# Altium schematic sheet USB Type C Power Controller.SchDoc: USB Type C Power Controller
size B; Organization: Drexel University; Address1: ECE Senior Design; Address2: 2018-2019; Address3: ECE-08; Revision: 1.0; SheetNumber: 6; SheetTotal: 9
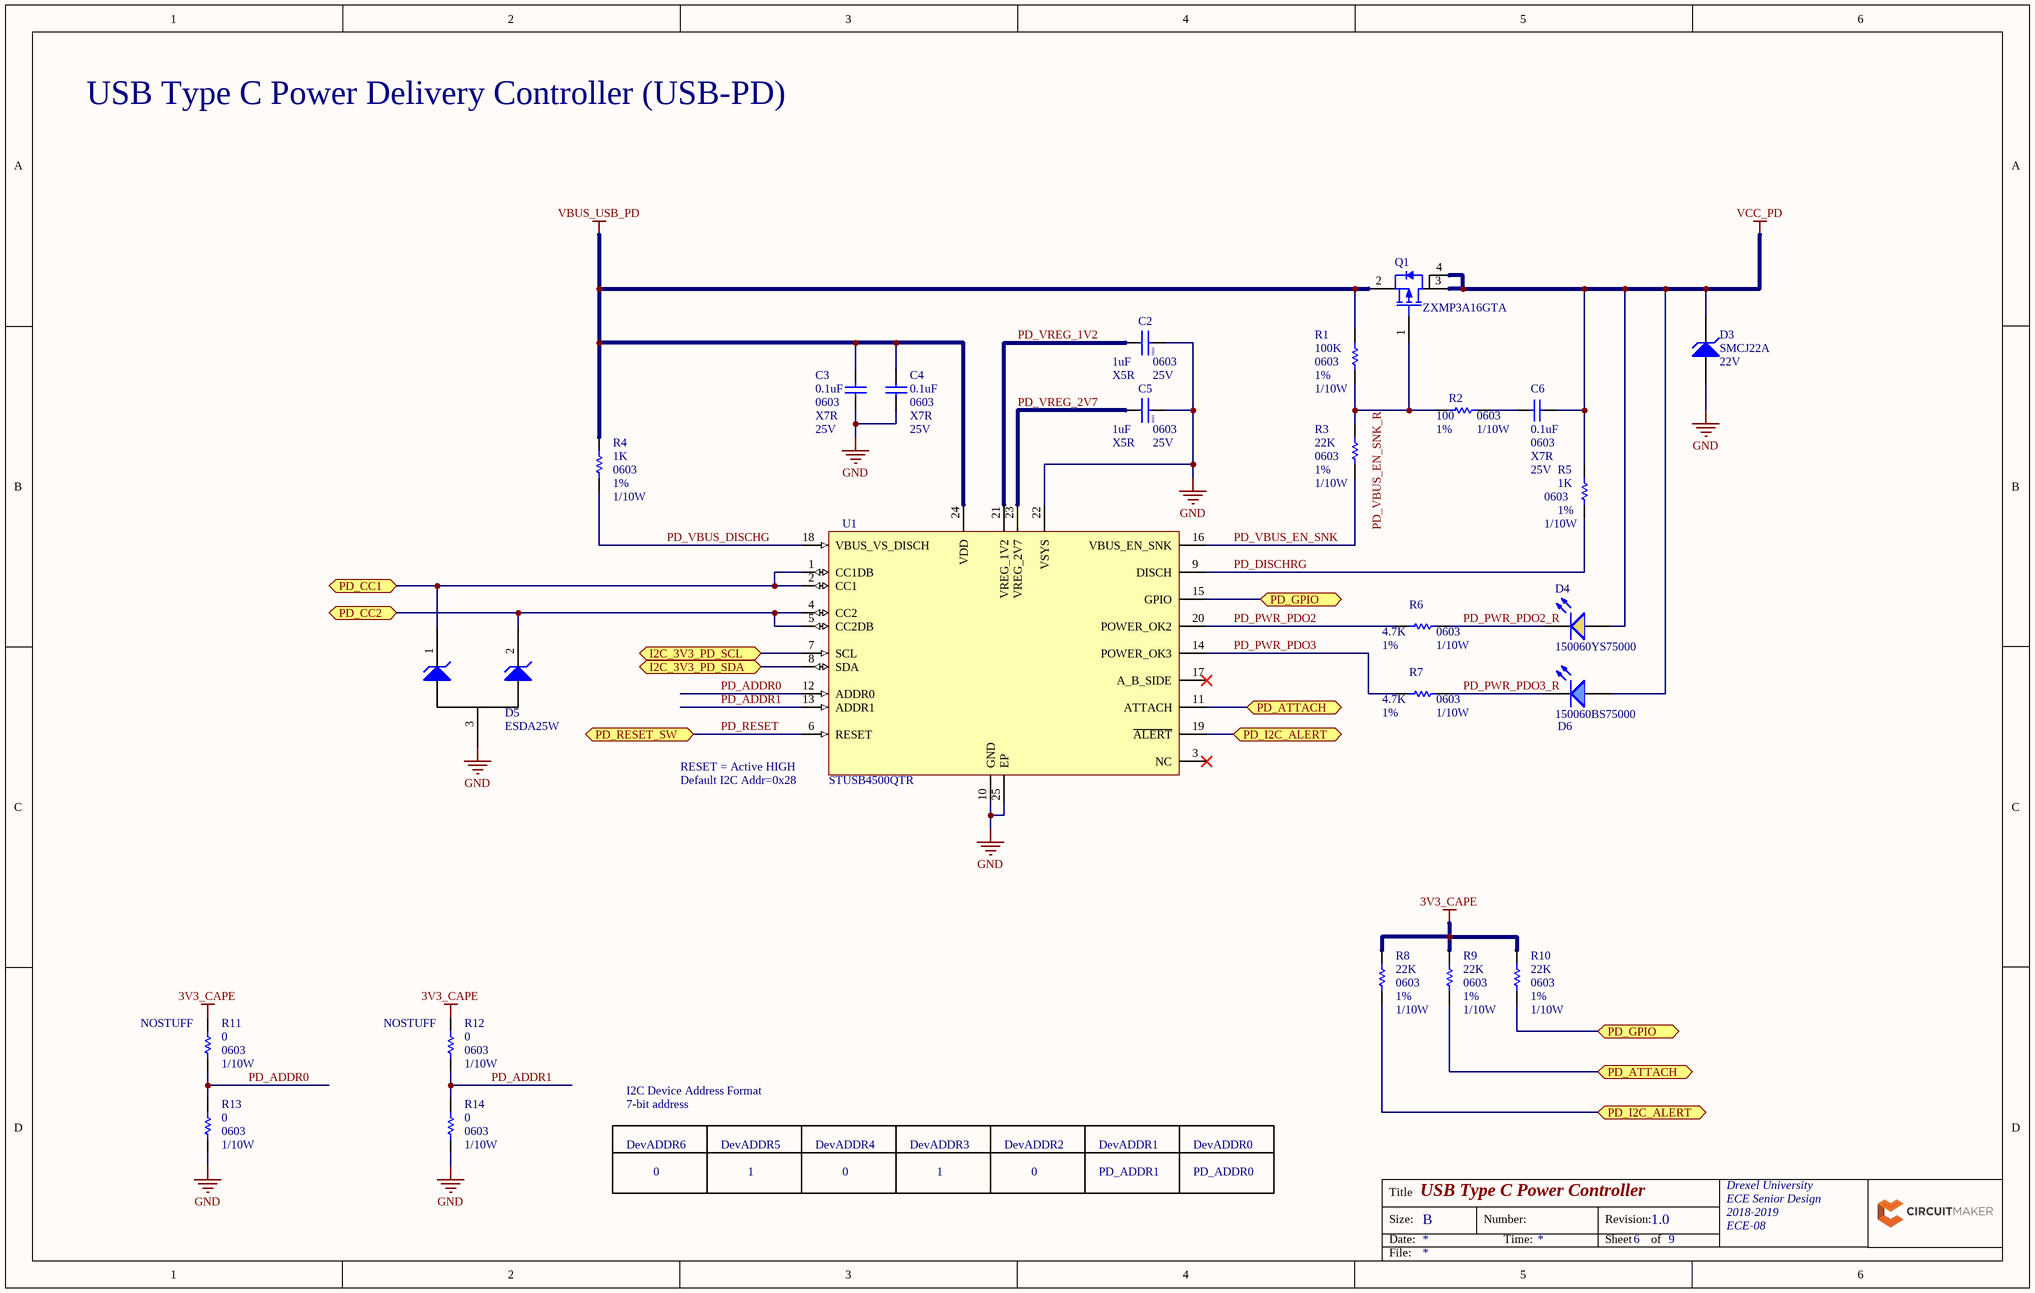
[diagram p0: USB Type C Power Controller.SchDoc]

## Parts
C2  Case/Package: 0603  Dielectric Characteristic: X5R  Capacitance: 1uF  Voltage Rating (DC): 25V  [PCB-bncvufzharetcg4gy1u6-1]  (hidden comment: Taiyo Yuden TMK107BJ105KA-T)
C3  Dielectric Characteristic: X7R  Voltage Rating (DC): 25V  Capacitance: 0.1uF  Package: 0603  [PCB-8usp83j76ntw2xroyu3n-1]  (hidden comment: Würth Elektronik 885012206071)
C4  Dielectric Characteristic: X7R  Voltage Rating (DC): 25V  Capacitance: 0.1uF  Package: 0603  [PCB-8usp83j76ntw2xroyu3n-1]  (hidden comment: Würth Elektronik 885012206071)
C5  Case/Package: 0603  Dielectric Characteristic: X5R  Capacitance: 1uF  Voltage Rating (DC): 25V  [PCB-bncvufzharetcg4gy1u6-1]  (hidden comment: Taiyo Yuden TMK107BJ105KA-T)
C6  Dielectric Characteristic: X7R  Voltage Rating (DC): 25V  Capacitance: 0.1uF  Package: 0603  [PCB-8usp83j76ntw2xroyu3n-1]  (hidden comment: Würth Elektronik 885012206071)
D3  SMCJ22A  Reverse Voltage: 22V  [PCB-gk7qhtajnaxh6qo3xtq4-1]
D4  150060YS75000  [PCB-pyamyqkabampf41w6k2s-1]
D5  Manufacturer Part Number: ESDA25W  [SOT65P210X110-3N]  (hidden comment: D Zener)
D6  150060BS75000  [PCB-q13q7q9xcpj9ke5g4s5g-1]
Q1  Manufacturer Part Number: ZXMP3A16GTA  [SOT230P700X160-4N]  (hidden comment: SYM-6957a0575e87b690-1)
R1  Resistance: 100K  Power Rating: 1/10W  Package: 0603  Tolerance: 1%  [PCB-js3e944hkesj3cskg8px-1]  (hidden comment: Res1)
R2  Case/Package: 0603  Power Rating: 1/10W  Resistance: 100  Resistance Tolerance: 1%  [PCB-85l72t2kcrpp9pohrqyw-1]  (hidden comment: Stackpole Electronics RMCF0603FG100R)
R3  Resistance: 22K  Resistance Tolerance: 1%  Case/Package: 0603  Power Rating: 1/10W  [RESC1608X55X25LL10T15]  (hidden comment: Yageo RC0603FR-0722KL)
R4  Case/Package: 0603  Power Rating: 1/10W  Resistance: 1K  Resistance Tolerance: 1%  [PCB-rzdzs5ckhrcob8ss0hvn-1]  (hidden comment: Stackpole Electronics RMCF0603FT1K00)
R5  Case/Package: 0603  Power Rating: 1/10W  Resistance: 1K  Resistance Tolerance: 1%  [PCB-rzdzs5ckhrcob8ss0hvn-1]  (hidden comment: Stackpole Electronics RMCF0603FT1K00)
R6  Resistance: 4.7K  Package: 0603  Power Rating: 1/10W  Tolerance: 1%  [CAPC1608X90X35NL15T15]  (hidden comment: 4k7)
R7  Resistance: 4.7K  Package: 0603  Power Rating: 1/10W  Tolerance: 1%  [CAPC1608X90X35NL15T15]  (hidden comment: 4k7)
R8  Resistance: 22K  Resistance Tolerance: 1%  Case/Package: 0603  Power Rating: 1/10W  [RESC1608X55X25LL10T15]  (hidden comment: Yageo RC0603FR-0722KL)
R9  Resistance: 22K  Resistance Tolerance: 1%  Case/Package: 0603  Power Rating: 1/10W  [RESC1608X55X25LL10T15]  (hidden comment: Yageo RC0603FR-0722KL)
R10  Resistance: 22K  Resistance Tolerance: 1%  Case/Package: 0603  Power Rating: 1/10W  [RESC1608X55X25LL10T15]  (hidden comment: Yageo RC0603FR-0722KL)
R11  Supplier Device Package: 0603  Resistance: 0  Power: 1/10W  [PCB-vghjuybc2rzv8513tm8h-1]  (hidden comment: Res1)
R12  Supplier Device Package: 0603  Resistance: 0  Power: 1/10W  [PCB-vghjuybc2rzv8513tm8h-1]  (hidden comment: Res1)
R13  Supplier Device Package: 0603  Resistance: 0  Power: 1/10W  [PCB-vghjuybc2rzv8513tm8h-1]  (hidden comment: Res1)
R14  Supplier Device Package: 0603  Resistance: 0  Power: 1/10W  [PCB-vghjuybc2rzv8513tm8h-1]  (hidden comment: Res1)
U1  STUSB4500QTR  [PCB-xnkkl1130v2ws1vguio4-1]

## Ports
I2C_3V3_PD_SCL (bidir), I2C_3V3_PD_SDA (bidir), PD_ATTACH, PD_CC1 (bidir), PD_CC2 (bidir), PD_GPIO, PD_I2C_ALERT, PD_RESET_SW (bidir)

## Nets
3V3_CAPE: R8.2 R9.2 R10.2 R11.2 R12.2
GND: C2.2 C3.1 C4.1 C5.2 D3.1(A) D5.3 R13.1 R14.1 U1.10(GND) U1.22(VSYS) U1.25(EP)
VBUS_USB_PD: C3.2 C4.2 Q1.2(S) R1.2 R4.2 U1.24(VDD)
VCC_PD: C6.2 D3.2(K) D4.2(A) D6.2(A) Q1.3(D) Q1.4 R5.2
I2C_3V3_PD_SCL: U1.7(SCL) ; port I2C_3V3_PD_SCL
I2C_3V3_PD_SDA: U1.8(SDA) ; port I2C_3V3_PD_SDA
PD_ADDR0: R11.1 R13.2 U1.12(ADDR0)
PD_ADDR1: R12.1 R14.2 U1.13(ADDR1)
PD_ATTACH: R9.1 U1.11(ATTACH) ; port PD_ATTACH
PD_CC1: D5.1 U1.1(CC1DB) U1.2(CC1) ; port PD_CC1
PD_CC2: D5.2 U1.4(CC2) U1.5(CC2DB) ; port PD_CC2
PD_DISCHRG: R5.1 U1.9(DISCH)
PD_GPIO: R10.1 U1.15(GPIO) ; port PD_GPIO
PD_I2C_ALERT: R8.1 U1.19(~{ALERT}) ; port PD_I2C_ALERT
PD_PWR_PDO2: R6.1 U1.20(POWER_OK2)
PD_PWR_PDO2_R: D4.1(K) R6.2
PD_PWR_PDO3: R7.1 U1.14(POWER_OK3)
PD_PWR_PDO3_R: D6.1(K) R7.2
PD_RESET: U1.6(RESET) ; port PD_RESET_SW
PD_VBUS_DISCHG: R4.1 U1.18(VBUS_VS_DISCH)
PD_VBUS_EN_SNK: R3.1 U1.16(VBUS_EN_SNK)
PD_VBUS_EN_SNK_R: Q1.1(G) R1.1 R2.1 R3.2
PD_VREG_1V2: C2.1 U1.21(VREG_1V2)
PD_VREG_2V7: C5.1 U1.23(VREG_2V7)
NetC6_1: C6.1 R2.2

Not connected (* = marked no-connect by the designer): U1 3(NC)* 17(A_B_SIDE)*

## Notes on the sheet
- USB Type C Power Delivery Controller (USB-PD)
- (near U1) RESET = Active HIGH
- (near U1) Default I2C Addr=0x28
- I2C Device Address Format
- 7-bit address
- DevADDR6
- 0
- DevADDR5
- 1
- DevADDR4
- DevADDR3
- DevADDR2
- DevADDR1
- PD_ADDR1
- DevADDR0
- PD_ADDR0
- Title
- Size:
- Date:
- B
- Number:
- Time:
- Revision:
- Sheet
- of
- File:
- (in symbol CMP-536b9a7387ce8cac-9) NOSTUFF

## Library data of the parts
C2 C5 = CMP-ac4e65478e587389-1: Cap Ceramic 1uF 25V X5R 10% SMD 0603 85°C Paper T/R; Lead-Free Status: Lead Free; Octopart URL: http://octopart.com/tmk107bj105ka-t-taiyo+yuden-198512; Packaging: Cut Tape (CT); Size-Width: 800 µm; Halogen Free Status: Halogen Free; Size-Length: 1.60 mm; Capacitance Tolerance: ±10%; OctopartID: ac4e65478e587389; Size-Height: 800 µm; Mounting Style: Surface Mount; Manufacturer Part Number: TMK107BJ105KA-T; Lifecycle Status: Active; Number of Pins: 2; RoHS: Compliant
C3 C4 C6 = CMP-034ac9768ab0dc8d-1: Multilayer Ceramic Capacitor, WCAP-CSGP Series, 0.1 F, 10%, X7R, 25 V, 0603 [1608 Metric]; RoHS: Compliant; Capacitance Tolerance: ±10%; OctopartID: 034ac9768ab0dc8d; Packaging: Cut Tape (CT); Octopart URL: http://octopart.com/885012206071-w%C3%BCrth+elektronik-53914780; Manufacturer Part Number: 885012206071
D3 = CMP-9cf25530e9434335-1: SMCJ Series 35.5 V 1.5 kW Surface Mount Uni-Directional TVS Diode - DO-214AB
D4 = CMP-12518863-3: Standard LEDs - SMD WL-SMCW SMDMono TpVw Waterclr 0603 Yellow; Forward Voltage: 2.00 V; Packaging: Tape & Reel (TR); Mounting Style: Surface Mount; Manufacturer Part Number: 150060YS75000; RoHS: Compliant
D5 = CMP-6dd1a4de068db216-2: ESD Suppressor TVS Uni-Dir 24V Automotive 3-Pin SOT-323 T/R; Voltage Rating (DC): 25.0 V; Power Rating: 150 W; Breakdown Voltage: 30.0 V (max); Lead-Free Status: Lead Free; Operating Voltage: 1.20 V; OctopartID: 6dd1a4de068db216; Mounting Style: Surface Mount; RoHS: Compliant; Size-Height: 1.10 mm; Case/Package: SOT-323; Packaging: Cut Tape (CT); Number of Pins: 3; Lifecycle Status: Active; Size-Width: 1.35 mm; Size-Length: 2.20 mm
D6 = CMP-12518856-7: Standard LEDs - SMD WL-SMCW SMDMono TpVw Waterclr 0603 Blue; Viewing Angle: 140 °; Luminous Intensity: 145 mcd; Forward Voltage: 3.20 V; Case/Package: 0603; Color: Blue; Octopart URL: http://octopart.com/150060bs75000-w%C3%BCrth+elektronik-29717775; RoHS: Compliant; Mounting Style: Surface Mount; Manufacturer Part Number: 150060BS75000; OctopartID: cf0a07c59f6310cd; Packaging: Cut Tape (CT)
Q1 = CMP-6957a0575e87b690-4: Trans MOSFET P-CH 30V 7.5A Automotive 4-Pin(3+Tab) SOT-223 T/R; Current Rating: -7.50 A; Rise Time: 3.82 ns; Drain to Source Voltage (Vds): 30.0 V; Power Dissipation: 2.00 W; Drain to Source Resistance (on) (Rds): 45.0 mΩ; Continuous Drain Current (Ids): 7.50 A; Voltage Rating (DC): -30.0 V; Lifecycle Status: Active; Octopart URL: https://octopart.com/zxmp3a16gta-diodes+inc.-660150; RoHS: Compliant; Case/Package: SOT-223; OctopartID: 6957a0575e87b690; Mounting Style: Surface Mount
R1 = CMP-47e38e6423219824-1: Res Thick Film 0603 100K Ohm 1% 0.1W(1/10W) ±100ppm/C Pad SMD T/R
R2 = CMP-39aef181352de669-1: Res Thick Film 0603 100 Ohm 1% 0.1W(1/10W) ±100ppm/C Pad SMD Automotive T/R; Lead-Free Status: Lead Free; Octopart URL: https://octopart.com/rmcf0603fg100r-stackpole+electronics-19212773; Manufacturer Part Number: RMCF0603FG100R; Mounting Style: Surface Mount; Packaging: Tape & Reel (TR); RoHS: Compliant; OctopartID: 39aef181352de669
R3 R8-R10 = CMP-1853446-5: Chip Resistor, 22 KOhm, +/- 1%, 0.1 W, -55 to 155 degC, 0603 (1608 Metric), RoHS, Tape and Reel; Voltage Rating (DC): 50.0 V; Lead-Free Status: Lead Free; Case/Package (SI): 1608; Number of Pins: 2; Size-Height: 450 µm; PackageDescription: 2-Pin Surface Mount Device, Body 1.6 x 0.8 mm; Size-Width: 800 µm; Seller Landing  Url: https://octopart-clicks.com/click/track?country=US&ak=8157f166&sig=0952a08&sid=5489&ppid=40952860&vpid=270386233&ct=offers; DatasheetVersion: Rev. 4, 02/2016; PackageReference: 0603; Size-Length: 1.60 mm; RoHS: Compliant; Mounting Style: Surface Mount; OctopartID: 2162ea18e018fea5; Manufacturer Part Number: RC0603FR-0722KL; Packaging: Cut Tape (CT), Tape & Reel (TR); Octopart Url: http://octopart.com/rc0603fr-0722kl-yageo-40952860; REACH SVHC Compliance: No SVHC
R4 R5 = CMP-fdb3359cf2042274-2: RMCF Series 0603 0.1 W 1 kOhm ±1 % ±100 ppm/°C SMT Thick Film Chip Resistor; Lead-Free Status: Lead Free; Packaging: Tape & Reel (TR); Octopart URL: http://octopart.com/rmcf0603ft1k00-stackpole+electronics-19213009; Mounting Style: Surface Mount; OctopartID: fdb3359cf2042274; RoHS: Compliant; Manufacturer Part Number: RMCF0603FT1K00
R6 R7 = CMP-3ca7f596181de360-9: Res Thick Film 0603 4.7K Ohm 1% 1/10W ±100ppm/°C Molded SMD SMD Paper Tape on Plastic Reel
R11-R14 = CMP-536b9a7387ce8cac-9: RES SMD 0 OHM JUMPER 1/10W 0603; Manufacturer Part Number: RC0603JR-070RL; Package / Case: 0603; Size / Dimension: 0.063" L x 0.032" W (1.60mm x 0.80mm); Features: Moisture Resistant; Series: RC
U1 = CMP-366efa1c2a7ce9a9-7: USB Type C and PD Sink Controller USB1.0/USB1.2/USB2.0/USB3.0 24-Pin QFN EP T/R